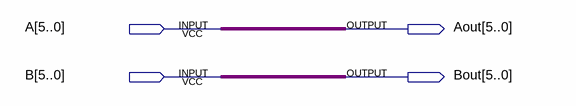
[diagram p0: schematic sheet]
// Quartus schematic nop.bdf as structural Verilog: 0 symbols, 4 pins
module nop (
  input  [5:0] A,
  input  [5:0] B,
  output [5:0] Aout,
  output [5:0] Bout
);


  assign Aout = A;
  assign Bout = B;
endmodule
